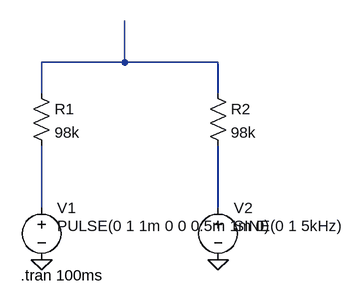
[diagram p0: schematic lab1_Sumator.asc]
lab1_Sumator.asc, the LTspice schematic file:
Version 4
SHEET 1 1056 680
WIRE 720 -304 720 -368
WIRE 720 -304 592 -304
WIRE 864 -304 720 -304
WIRE 592 -256 592 -304
WIRE 864 -256 864 -304
WIRE 592 -80 592 -176
WIRE 864 -80 864 -176
FLAG 592 0 0
FLAG 864 0 0
SYMBOL res 576 -272 R0
SYMATTR InstName R1
SYMATTR Value 98k
SYMBOL res 848 -272 R0
SYMATTR InstName R2
SYMATTR Value 98k
SYMBOL voltage 592 -96 R0
WINDOW 3 24 44 Left 2
WINDOW 123 0 0 Left 2
WINDOW 39 0 0 Left 2
SYMATTR Value PULSE(0 1 1m 0 0 0.5m 1m 0)
SYMATTR InstName V1
SYMBOL voltage 864 -96 R0
WINDOW 3 24 44 Left 2
WINDOW 123 0 0 Left 2
WINDOW 39 0 0 Left 2
SYMATTR Value SINE(0 1 5kHz)
SYMATTR InstName V2
TEXT 560 24 Left 2 !.tran 100ms

The netlist it stands for:
* lab1_Sumator.asc
R1 N001 N002 98k
R2 N001 N003 98k
V1 N002 0 PULSE(0 1 1m 0 0 0.5m 1m 0)
V2 N003 0 SINE(0 1 5kHz)
.tran 100ms
.backanno
.end